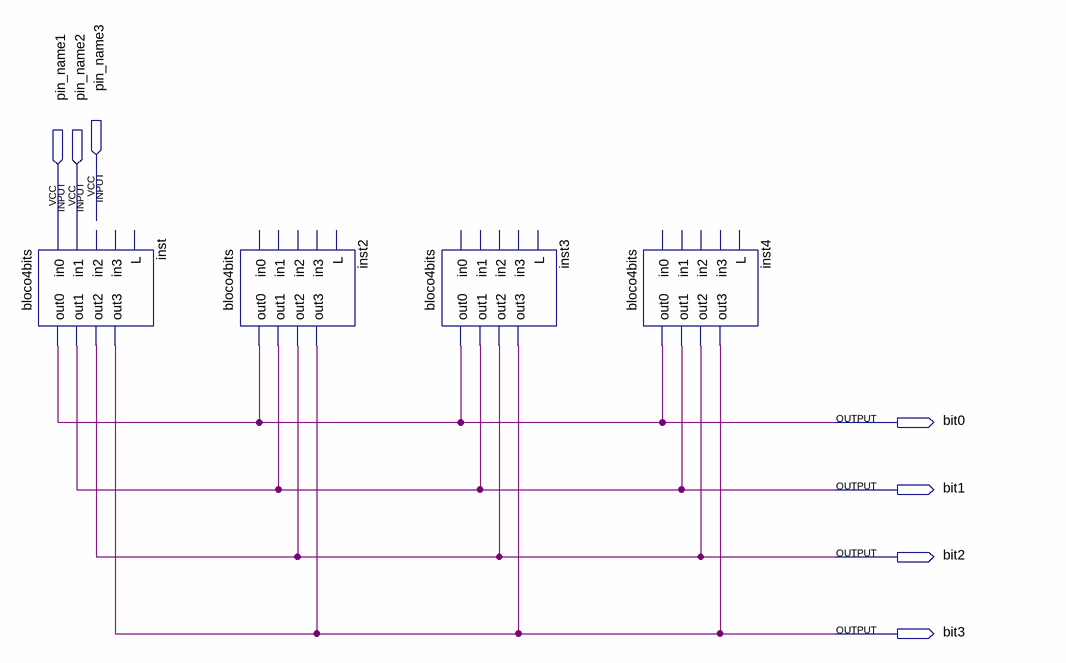
[diagram p0: schematic sheet]
// Quartus schematic blocoROM.bdf as structural Verilog: 4 symbols, 7 pins
module blocoROM (
  input  pin_name3,
  input  pin_name1,
  input  pin_name2,
  output bit0,
  output bit1,
  output bit2,
  output bit3
);

  bloco4bits inst (
    .in0(pin_name1), .in1(pin_name2), .out0(bit0), .out1(bit1), .out2(bit2), .out3(bit3));  // open: in2, in3, L
  bloco4bits inst2 (.out0(bit0), .out1(bit1), .out2(bit2), .out3(bit3));  // open: in0, in1, in2, in3, L
  bloco4bits inst3 (.out0(bit0), .out1(bit1), .out2(bit2), .out3(bit3));  // open: in0, in1, in2, in3, L
  bloco4bits inst4 (.out0(bit0), .out1(bit1), .out2(bit2), .out3(bit3));  // open: in0, in1, in2, in3, L
endmodule
